# Altium project InterfazRS232Radio.PrjPcb
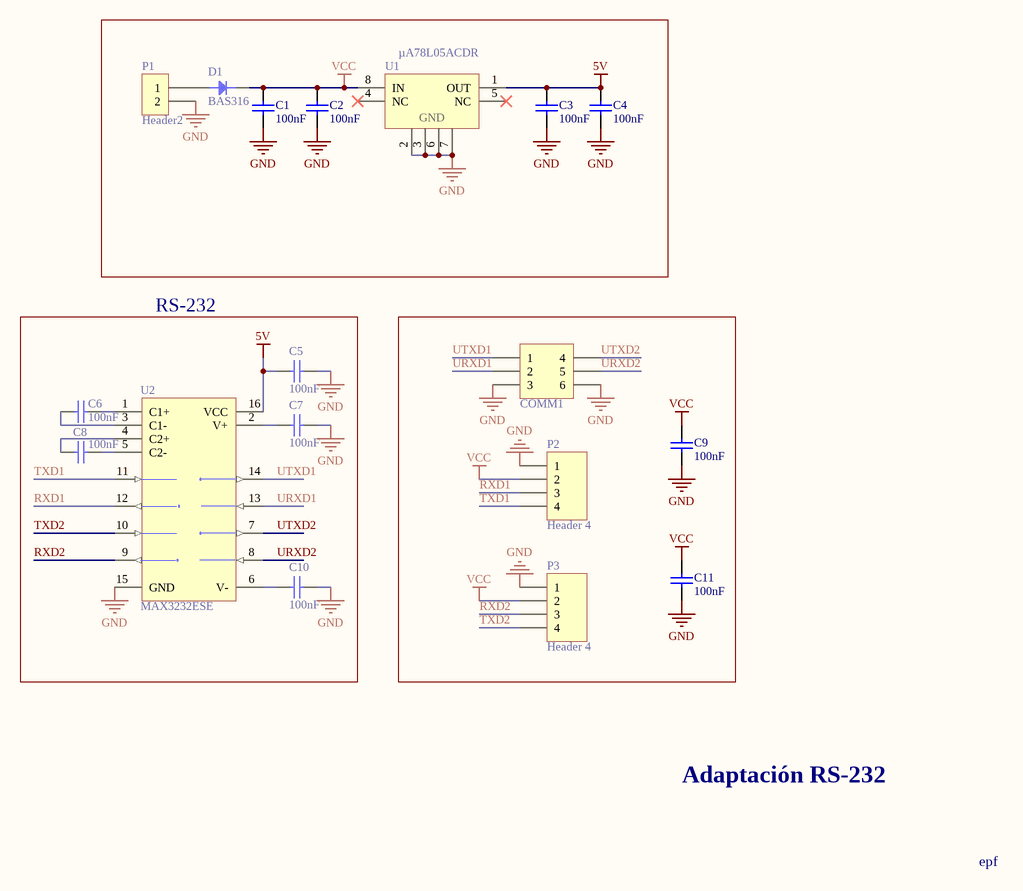
[diagram p0: InterfazRS232Radio.SchDoc]
1 sheet, 18 parts. Net scope: global (net labels, ports and power ports of the same name join across sheets).
Board file: InterfazRS232Radio.PcbDoc

## Sheet InterfazRS232Radio.SchDoc
size A4

### Parts
C1  value 100nF  [0805_CAP]  (hidden comment: Capacitor)
C2  value 100nF  [0805_CAP]  (hidden comment: Capacitor)
C3  value 100nF  [0805_CAP]  (hidden comment: Capacitor)
C4  value 100nF  [0805_CAP]  (hidden comment: Capacitor)
C5  value 100nF  [0805_CAP]  (hidden comment: Capacitor)
C6  value 100nF  [0805_CAP]  (hidden comment: Capacitor)
C7  value 100nF  [0805_CAP]  (hidden comment: Capacitor)
C8  value 100nF  [0805_CAP]  (hidden comment: Capacitor)
C9  value 100nF  [0805_CAP]  (hidden comment: Capacitor)
C10  value 100nF  [0805_CAP]  (hidden comment: Capacitor)
C11  value 100nF  [0805_CAP]  (hidden comment: Capacitor)
COMM1  AP_COMM  [HDR2X3_CEN]  (value not drawn)
D1  BAS316  [SOD-323]
P1  Header2  [Header2Macho]
P2  Header 4  [HDR1X4]
P3  Header 4  [HDR1X4]
U1  µA78L05ACDR  [D008_N]
U2  MAX3232ESE  [SOIC127P602-16BN]

### Blocks framed on the sheet
RS-232: C5-C8 C10 U2

### Nets
5V: C3.1 C4.1 C5.2 U1.1(OUT) U2.16(VCC)
GND: C1.2 C2.2 C3.2 C4.2 C5.1 C7.1 C9.2 C10.1 C11.2 COMM1.3 COMM1.6 P1.2 P2.1 P3.1 U1.2(GND) U1.3(GND) U1.6(GND) U1.7(GND) U2.15(GND)
VCC: C1.1 C2.1 C9.1 C11.1 D1.1(K) P2.2 P3.2 U1.8(IN)
RXD1: P2.3 U2.12(R1OUT)
RXD2: P3.3 U2.9(R2OUT)
TXD1: P2.4 U2.11(T1IN)
TXD2: P3.4 U2.10(T2IN)
URXD1: COMM1.2 U2.13(R1IN)
URXD2: COMM1.5 U2.8(R2IN)
UTXD1: COMM1.1 U2.14(T1OUT)
UTXD2: COMM1.4 U2.7(T2OUT)
NetC6_1: C6.1 U2.1(C1+)
NetC6_2: C6.2 U2.3(C1-)
NetC7_2: C7.2 U2.2(V+)
NetC8_1: C8.1 U2.5(C2-)
NetC8_2: C8.2 U2.4(C2+)
NetC10_2: C10.2 U2.6(V-)
NetD1_2: D1.2(A) P1.1

Not connected (* = marked no-connect by the designer): U1 4(NC)* 5(NC)*

### Notes on the sheet
- Adaptación RS-232
- epf

### Library data of the parts
C1-C11 = Cap
COMM1 = AP_COMM: Header, 3-Pin, Dual row; LatestRevisionDate: 17-Jul-2002; LatestRevisionNote: Re-released for DXP Platform.; Publisher: Altium Limited
P2 P3 = Header 4: Header, 4-Pin; LatestRevisionDate: 17-Jul-2002; LatestRevisionNote: Re-released for DXP Platform.; Publisher: Altium Limited
U1 = µA78L05ACDR: Positive-Voltage Regulator; Published: 15-Apr-2002; LatestRevisionDate: 13-Apr-2006; LatestRevisionNote: IPC-7351 Footprint Added.; DatasheetVersion: Jul-2000; PackageVersion: Jan-1998; PackageReference: D008; Publisher: Altium Limited; PackageDescription: 8-Pin Small Outline Integrated Circuit 1.27 mm Pitch; Code_IPC: SOIC127P600-8; ComponentLink1Description: Manufacturer Link; ComponentLink1URL: http://www.ti.com/; ComponentLink2Description: Datasheet; ComponentLink2URL: http://www-s.ti.com/sc/ds/ua78l05a.pdf
U2 = MAX3232ESE+